# Altium schematic sheet Power.SchDoc
size A4; SheetNumber: 5; SheetTotal: 6
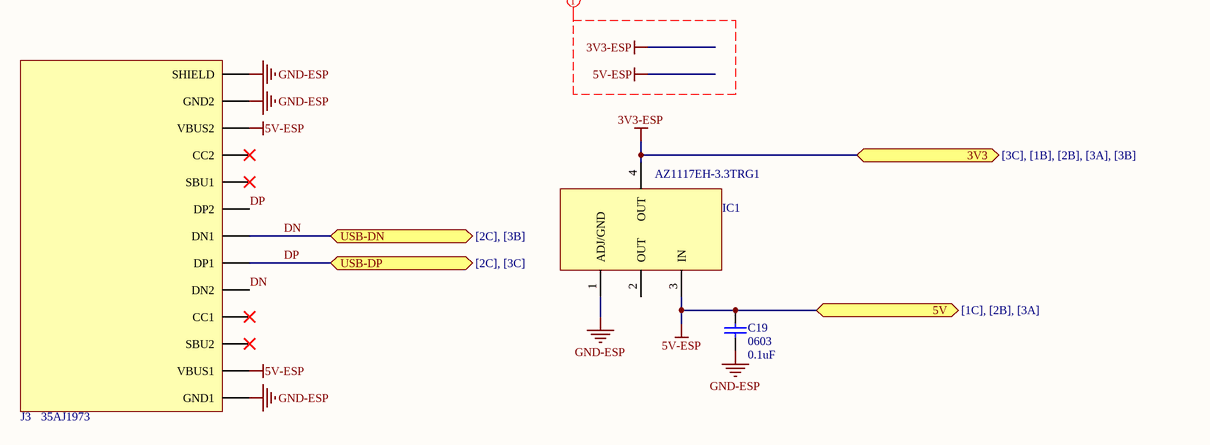
[diagram p0: Power.SchDoc]

## Parts
C19  value 0.1uF  Package: 0603  [SMD-CAP-0603-YAGEO]  (hidden comment: 0.1 µF ±10% 16V Ceramic Capacitor X7R 0603 (1608 Metric))
IC1  MP: AZ1117EH-3.3TRG1  [SOT-223-3-DI]  (hidden comment: Linear Voltage Regulator IC Positive Fixed 1 Output 1A SOT-223-3)
J3  Supplier Part Number: 35AJ1973  [TYPE-C-HOR-RECEPTACLE-24PIN-MOLEX]  (hidden comment: USB-C (USB TYPE-C) USB 2.0 Receptacle Connector 24 (16+8 Dummy) Position Surface Mount, Right Angle; Through Hole)

## Ports
3V3 (bidir, see [3C], [1B], [2B], [3A], [3B]), 5V (bidir, see [1C], [2B], [3A]), USB-DN (bidir, see [2C], [3B]), USB-DP (bidir, see [2C], [3C])

## Nets
3V3-ESP: IC1.4(OUT) ; port 3V3
5V-ESP: C19.2 IC1.3(IN) J3.A4B9(VBUS1) J3.B4A9(VBUS2) ; port 5V
GND-ESP: C19.1 IC1.1(ADJ/GND) J3.A1B12(GND1) J3.B1A12(GND2) J3.SHIELD
DN: J3.A7(DN1) J3.B7(DN2) ; port USB-DN
DP: J3.A6(DP1) J3.B6(DP2) ; port USB-DP

Not connected (* = marked no-connect by the designer): IC1 2(OUT); J3 A5(CC1)* A8(SBU1)* B5(CC2)* B8(SBU2)*

## Layout directives
net class POWER: 3V3-ESP, 5V-ESP

## Library data of the parts
C19 = CAP; 0.1uF; 16V; 0603; SMD; CC0603KRX7R7BB104: 0603 0.1 uF 16 V ±10 % Tolerance X7R SMT Multilayer Ceramic Capacitor; Manufacturer: Yageo; Insulation Resistance: 100GR; Designer: TVBac; Supplier: Digikey; Supplier Part Number: 311-1088-1-ND; Manufacturer Part Number: CC0603KRX7R7BB104; RoHS: Yes; Category: Ceramic Capacitors; Stock: 8705780; Pricing: 1=0.1, 10=0.042, 50=0.0238, 100=0.0185, 500=0.01392, 1000=0.01094, 4000=0.00915, 8000=0.00836, 12000=0.00796, 28000=0.00756, 100000=0.00547, 200000=0.00529, 400000=0.00497 (USD); Mounting Technology: Surface Mount; Case/Package: 0603; Pins: 2; Case Code (Metric): 1608; Case Code (Imperial): 0603; Material: Ceramic; Min Operating Temperature: -55°C; Max Operating Temperature: 125°C; Voltage Rating: 16V; Tolerance: 10%; Voltage Rating (DC): 16V; Package Quantity: 1; Packaging: Tape and Reel; Dielectric: X7R; Termination: SMD/SMT; Voltage: 16V; Series: CC; Length: 1.6mm; Width: 0.031inch; Height: 0.8mm; Thickness: 0.035inch; Depth: 0.8mm; Radiation Hardening: No; Reach SVHC Compliant: No; Lead Free: Lead Free; Halogen Free: Halogen Free; RoHS Compliant: Yes; ComponentLink1URL: https://datasheet.ciiva.com/11786/0900766b80d84f1d-11786077.pdf?src-supplier=Rs; ComponentLink1Description: https://datasheet.ciiva.com/11786/0900766b80d84f1d-11786077.pdf?src-supplier=Rs; ComponentLink2URL: https://datasheet.ciiva.com/8033/70765-8033799.pdf?src-supplier=Element14; ComponentLink2Description: https://datasheet.ciiva.com/8033/70765-8033799.pdf?src-supplier=Element14; ComponentLink3URL: https://datasheet.ciiva.com/7978/1489800-7978141.pdf?src-supplier=Element14; ComponentLink3Description: https://datasheet.ciiva.com/7978/1489800-7978141.pdf?src-supplier=Element14; ComponentLink4URL: https://datasheet.ciiva.com/28450/1489800-28450552.pdf?src-supplier=Element14; ComponentLink4Description: https://datasheet.ciiva.com/28450/1489800-28450552.pdf?src-supplier=Element14; ComponentLink5URL: https://datasheet.ciiva.com/46430/1734573-46430156.pdf?src-supplier=Element14; ComponentLink5Description: https://datasheet.ciiva.com/46430/1734573-46430156.pdf?src-supplier=Element14; ComponentLink6URL: https://datasheet.ciiva.com/144/mlccorderingcode-144183.pdf?src-supplier=Digikey; ComponentLink6Description: https://datasheet.ciiva.com/144/mlccorderingcode-144183.pdf?src-supplier=Digikey; ComponentLink7URL: https://datasheet.ciiva.com/144/mlccorderingcode-144182.pdf?src-supplier=Digikey; ComponentLink7Description: https://datasheet.ciiva.com/144/mlccorderingcode-144182.pdf?src-supplier=Digikey; ComponentLink8URL: https://datasheet.ciiva.com/144/mlccorderingcode-144184.pdf?src-supplier=Digikey; ComponentLink8Description: https://datasheet.ciiva.com/144/mlccorderingcode-144184.pdf?src-supplier=Digikey; ComponentLink9URL: https://datasheet.ciiva.com/8033/1734573-8033797.pdf?src-supplier=Element14; ComponentLink9Description: https://datasheet.ciiva.com/8033/1734573-8033797.pdf?src-supplier=Element14; ComponentLink10URL: https://datasheet.ciiva.com/13395/upy-gphc-x7r-6-3v-to-50v-8-13395674.pdf?src-supplier=Mouser; ComponentLink10Description: https://datasheet.ciiva.com/13395/upy-gphc-x7r-6-3v-to-50v-8-13395674.pdf?src-supplier=Mouser; ComponentLink11URL: https://datasheet.ciiva.com/11464/upy-gphc-x7r-6-3v-to-50v-8-11464735.pdf?src-supplier=Avnet; ComponentLink11Description: https://datasheet.ciiva.com/11464/upy-gphc-x7r-6-3v-to-50v-8-11464735.pdf?src-supplier=Avnet; ComponentLink12URL: https://datasheet.ciiva.com/15165/getdatasheetpartid-63554-15165387.pdf?src-supplier=Verical; ComponentLink12Description: https://datasheet.ciiva.com/15165/getdatasheetpartid-63554-15165387.pdf?src-supplier=Verical; ComponentLink13Description: Link Digikey; ComponentLink13URL: https://www.digikey.com/en/products/detail/yageo/CC0603KRX7R7BB104/302822
IC1 = LDO; 3V3; 1A; SMD; AZ1117EH-3.3TRG1: Linear Voltage Regulator IC 1 Output 1A SOT-223; MF: Diodes Inc.; Designer: TVBac; Package: SOT-223 Diodes Inc.; Value: *; Price: None; SnapEDA_Link: https://www.snapeda.com/parts/AZ1117EH-3.3TRG1/Diodes%20Inc./view-part/482930/?ref=snap; Availability: Unavailable; ComponentLink1Description: Link Digikey; ComponentLink1URL: https://www.digikey.com/en/products/detail/diodes-incorporated/AZ1117EH-3-3TRG1/5001329
J3 = Type-C; USB; HOR; RECEPTACLE;  24PIN; 217179-0001: USB Connector, 16 Contact(s), Female, Right Angle, Surface Mount Terminal, Locking, Receptacle; Manufacturer: Molex; USB Standard: USB 2.0; Current Rating: 1.25A; Number of Contacts: 16; Voltage Rating: 30V; Designer: TVBac; Supplier: Avnet; Manufacturer Part Number: 217179-0001; RoHS: No; Category: Connectors; Stock: 7200; Pricing: 1=1.02, 25=0.853, 100=0.722, 250=0.677, 500=0.631 (USD); Contact Material: Nickel,Gold; Min Operating Temperature: -40°C; Max Operating Temperature: 85°C; Gender: Receptacle; Height: 3.36mm; ComponentLink1Description: Link Digikey; ComponentLink1URL: https://www.digikey.com/en/products/detail/molex/2171790001/13913749